# Altium schematic sheet linearInjector_main.SchDoc
size A4
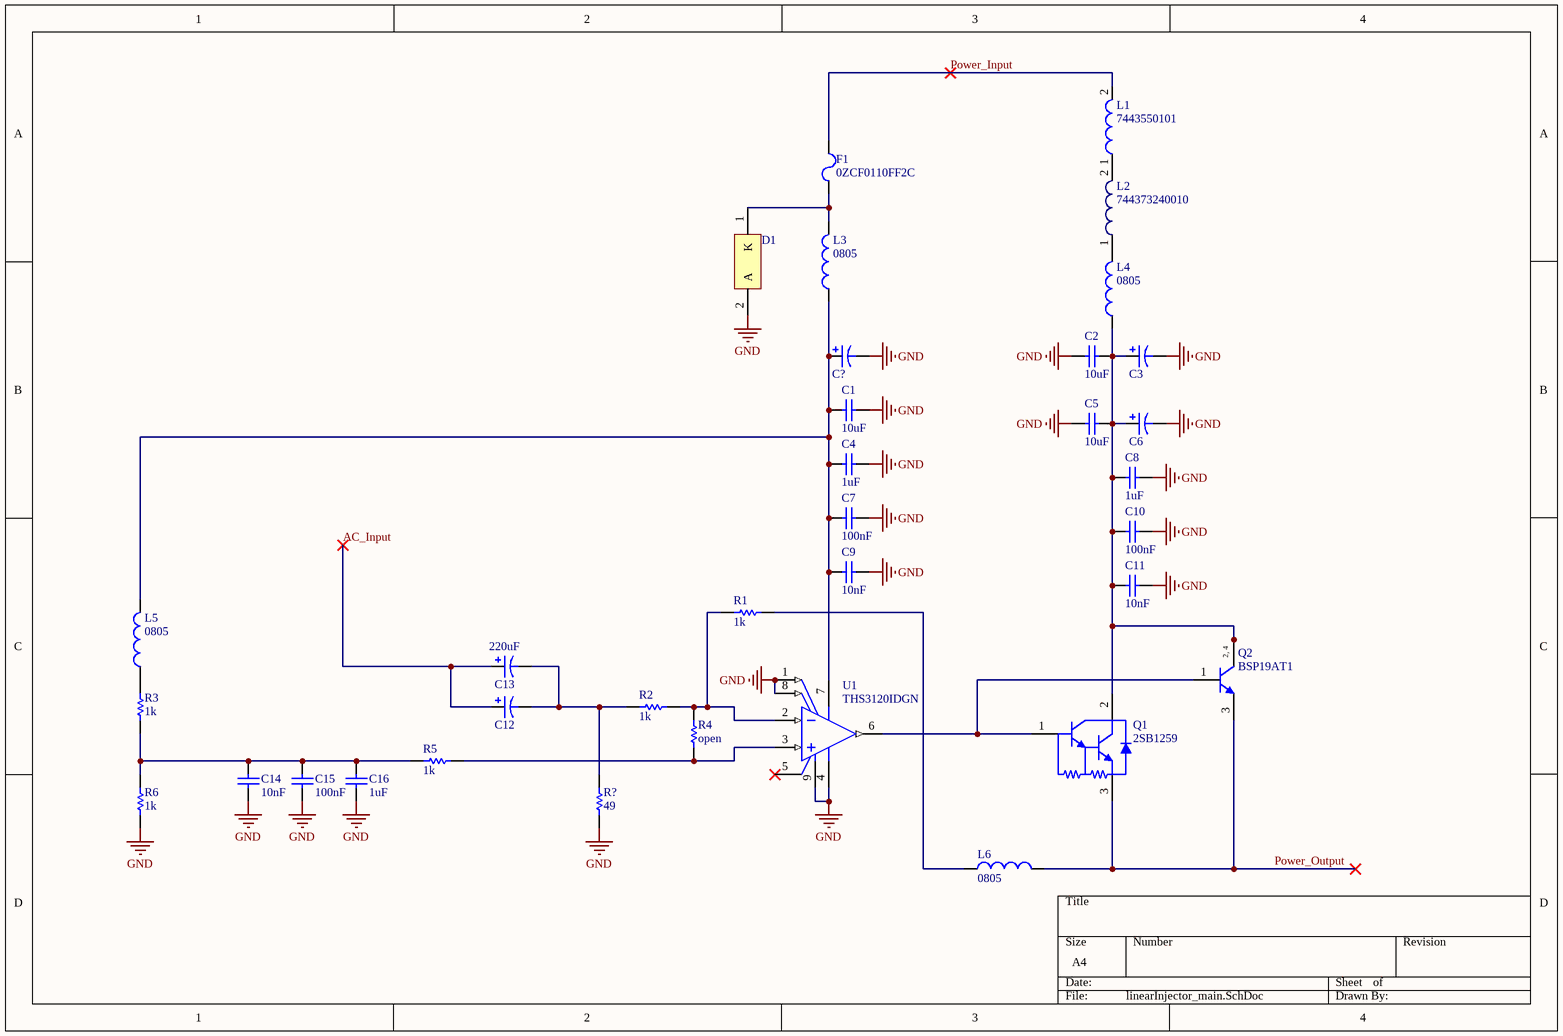
[diagram p0: linearInjector_main.SchDoc]

## Parts
C1  10uF  [CAPC1206(3216)130_M]
C2  10uF  [CAPC1206(3216)130_L]
C3  EEE-FK1E221P  [PNSC-EEE-FK1E221P_N]  (value not drawn)
C4  1uF  [CAPC0805(2012)75_M]
C5  10uF  [CAPC1206(3216)130_L]
C6  EEE-FK1E221P  [PNSC-EEE-FK1E221P_N]  (value not drawn)
C7  100nF  [CAPC0805(2012)75_M]
C8  1uF  [CAPC0805(2012)75_M]
C9  10nF  [CAPC0805(2012)75_M]
C10  100nF  [CAPC0805(2012)75_M]
C11  10nF  [CAPC0805(2012)75_M]
C12  EEE-FK1E221P  [PNSC-EEE-FK1E221P_N]  (value not drawn)
C13  220uF  [PNSC-EEE-FK1E221P_N]
C14  10nF  [CAPC0805(2012)75_M]
C15  100nF  [CAPC0805(2012)75_M]
C16  1uF  [CAPC0805(2012)75_M]
C?  EEE-FK1E221P  [PNSC-EEE-FK1E221P_N]  (value not drawn)
D1  MBRM120LT3  [ONSC-POWERMITE-2-457-04_D_V]  (value not drawn)
F1  0ZCF0110FF2C  [TECO-SMD100F-2_V]
L1  7443550101  [WE-HCI-1350]
L2  744373240010  [WE-LHMI 4020]
L3  0805  [INDC2013X105X50ML20T30]
L4  0805  [INDC2013X105X50ML20T30]
L5  0805  [INDC2013X105X50ML20T30]
L6  0805  [INDC2013X105X50ML20T30]
Q1  2SB1259  [ONSC-TO-220-3-221A-09]
Q2  BSP19AT1  [ONSC-SOT-223-4-318E-04_V]
R1  1k  [RESC0805(2012)_M]
R2  1k  [RESC0805(2012)_M]
R3  1k  [RESC0805(2012)_M]
R4  open  [RESC0805(2012)_M]
R5  1k  [RESC0805(2012)_M]
R6  1k  [RESC0805(2012)_M]
R?  49  [RESC0805(2012)_M]
U1  THS3120IDGN  [DGN0008D_L]

## Nets
GND: C1.2 C2.2 C3.2(-) C4.1 C5.2 C6.2(-) C7.1 C8.1 C9.1 C10.1 C11.1 C14.1 C15.1 C16.1 C?.2(-) D1.2(A) R6.1 R?.1 U1.1(REF) U1.4(VS-) U1.8(PD) U1.9(EP)
AC_Input: C12.1(+) C13.1(+)
Power_Input: F1.2 L1.2
Power_Output: L6.2 Q1.3(E) Q2.3(E)
NetC1_1: C1.1 C4.2 C7.2 C9.2 C?.1(+) L3.1 L5.2 U1.7(VS+)
NetC2_1: C2.1 C3.1(+) C5.1 C6.1(+) C8.2 C10.2 C11.2 L4.1 Q1.2(C) Q2.2(C) Q2.4(C)
NetC12_2: C12.2(-) C13.2(-) R2.1 R?.2
NetC14_2: C14.2 C15.2 C16.2 R3.1 R5.1 R6.2
NetD1_1: D1.1(K) F1.1 L3.2
NetL1_1: L1.1 L2.2
NetL2_1: L2.1 L4.2
NetL5_1: L5.1 R3.2
NetL6_1: L6.1 R1.2
NetQ1_1: Q1.1(B) Q2.1(B) U1.6(VOUT)
NetR1_1: R1.1 R2.2 R4.2 U1.2(VIN-)
NetR4_1: R4.1 R5.2 U1.3(VIN+)

Not connected (* = marked no-connect by the designer): U1 5(NC)*

## Notes on the sheet
- (in symbol CMP-1048-00457-1) 2, 4

## Library data of the parts
C1 C2 C5 = CMP-1037-04970-1: Case-Metric: 3216; Rated Voltage: 10 V; Tolerance: -20% to +80%; Case-EIA: 1206; Value: 10uF; Technology: SMT; Max Thickness: 1.3 mm
C3 C6 C12 C? = CMP-1665-00017-1: CAP ALUM 220UF 20% 25V SMD; Datasheet: http://industrial.panasonic.com/cdbs/www-data/pdf/RDE0000/ABA0000C1181.pdf; Partnumber: EEE-FK1E221P
C4 C7 C8 C10 C15 C16 = CMP-1036-03812-1: Case-EIA: 0805; Value: 10nF; Rated Voltage: 10 V; Tolerance: -20% to +80%; Case-Metric: 2012; Technology: SMT; Max Thickness: 0.75 mm
C9 C11 C14 = CMP-1036-03812-1: Case-EIA: 0805; Rated Voltage: 10 V; Tolerance: -20% to +80%; Case-Metric: 2012; Technology: SMT; Max Thickness: 0.75 mm; Value: 10nF
C13 = CMP-1665-00017-1: CAP ALUM 220UF 20% 25V SMD EEE-FK1E221P; Datasheet: http://industrial.panasonic.com/cdbs/www-data/pdf/RDE0000/ABA0000C1181.pdf; Partnumber: EEE-FK1E221P
D1 = CMP-1055-00282-1: Schottky Power Rectifier, 2-Pin Powermite, Tape and Reel; Manufacturer: On Semiconductor; Note1: 0; IFSM Max (A): 50; Configuration: Single; Mounting Technology: Surface Mount; PackageReference: POWERMITE-2-457-04; PackageDescription: 2-Pin POWERMITE, Body 1.965 x 1.9 mm; PackageVersion: Rev. F, 05/2013; RoHS: FALSE; DatasheetVersion: Rev. 7; ComponentLink3URL: http://www.onsemi.com/pub_link/Collateral/457-04.PDF; ComponentLink2Description: Datasheet; ComponentLink3Description: Package Specification; ComponentLink1URL: http://www.onsemi.com/; ComponentLink1Description: Manufacturer URL; ComponentLink2URL: http://www.onsemi.cn/pub_link/Collateral/MBRM120L-D.PDF; PartNumber: MBRM120LT3; Packing: Tape and Reel
F1 = CMP-2000-05420-1: ptc; Manufacturer: TEConnectivity/CircuitProtection; Part No: SMD100F-2; Typical Power Dissipation: 1.7(Max)W; Agency Approvals: CSA/TUV/UL; Lead Diameter: N/R; Minimum Initial Resistance: 0.12Ohm; Hold Current: 1.1A; Trip Current: 2.2A; Maximum Voltage Rating: 30V; Maximum Post Trip Resistance: 0.48Ohm; Maximum Current Rating: 40A; Datasheet URL: http://datasheet.octopart.com/SMD100F-2-Tyco-Electronics-datasheet-11085073.pdf; Mounting: SurfaceMount; Applications: N/A; Terminal Pitch: N/A; Dimension: N/A; RoHS: Yes; Package Reference: SMD100F-2; Package Description: 2-Pin Surface Mount Device, Body 7.34 x 5.12 mm; Operating Temperature: 85(Max)C; Wire Form: N/R; Number of Terminals: 2; Maximum Trip Time: N/A; Seated Plane Height: N/R; Manufacturer URL: http://www.te.com/; Package/Case: 2920; Family: SMD; Packaging: TapeandReel; Datasheet Version: May-11; Maximum Initial Resistance: N/A
L1 = CMP-0226-00031-1: SMD Flat Wire High Current Inductor WE-HCI, L=10.0 µH; Inductance: 10.0 ÂµH; DatasheetVersion: ver 1, Aug-2009; ComponentLink2Description: Datasheet; PackageDescription: Inductor, 2-Leads, Body 13.0 x 12.8 mm; ComponentLink2URL: http://www.we-online.de/katalog/media/pdf/7443550101.pdf; PackageReference: WE-HCI-1350; ComponentLink1URL: http://www.we-online.com; PackageVersion: 2008; ComponentLink1Description: Manufacturer Link
L2 = CMP-1353-00038-1: SMD Power Inductor WE-LHMI, L=0.10 µH; Manufacturer: Wuerth Elektronik; Inductance: 0.10 ÂµH; ComponentLink2URL: http://katalog.we-online.de/kataloge/eisos/media/pdf/744373240010.pdf; ComponentLink2Description: Datasheet; PartNumber: 744373240010; ComponentLink1URL: http://www.we-online.com; ComponentLink1Description: Manufacturer URL; PackageReference: WE-LHMI 4020
L3-L6 = CMP-1660-00003-1: Core Material: Ferrite; Current Rating: 6 A; Tolerance: 30%; Resistance: 4 mohm; Impedance: 21 Ohm; Min Operating Temperature: -40 degC; Width: 1.25 mm; PackageDescription: 2-Pin Surface Mount Device, Body 2 x 1.25 mm; Mounting Technology: Surface Mount; Package Quantity: 1; DatasheetVersion: 08/2016; Mount: Surface Mount; Max Operating Temperature: 125 degC; Height: 0.85 mm; ComponentLink1URL: http://www.t-yuden.com/; Case Code (Metric): 2012; ComponentLink1Description: Manufacturer URL; Case\Package: 0805; ComponentLink2URL: http://ds.yuden.co.jp/TYCOMPAS/ut/detail.do?productNo=FBMJ2125HM210NT&fileName=FBMJ2125HM210NT_SS&mode=specSheetDownload; Case Code (Imperial): 0805; Packaging: Tape and Reel; ComponentLink2Description: Datasheet; PackageReference: 0805; RoHSCompliant: true; Max Current Rating: 6 A; Length: 2 mm; REACH SVHC: Unknown
Q1 = CMP-1031-00034-1: PartNumber: MJE5740G; Manufacturer: On Semiconductor; Packing: Tube; Polarity: NPN; IC Continuous (A): 8; PackageReference: TO-220-3-221A-09; ComponentLink2URL: http://www.onsemi.com/pub_link/Collateral/MJE5740-D.PDF; ComponentLink1URL: http://www.onsemi.com/; Mounting Technology: Through Hole; ComponentLink2Description: Datasheet; ComponentLink1Description: Manufacturer URL; ComponentLink3URL: http://www.onsemi.com/pub_link/Collateral/221A-09.PDF; PackageDescription: 3-Pin Flange Mount, Vertical Straight Lead, Body 9.97 x 4.445 mm, Pitch 2.54 mm; PackageVersion: Rev. AG, 09/2011; DatasheetVersion: Rev. 11; RoHS: TRUE; ComponentLink3Description: Package Specification
Q2 = CMP-1048-00457-1: NPN Silicon Expitaxial Transistor, 4-Pin SOT-223, Tape and Reel; Manufacturer: On Semiconductor; fT Min (MHz): 70; IC Continuous (A): 0.1; PackageDescription: 4-Pin Small Outline Transistor, Body 6.5 x 3.5 mm, Pitch 2.3 mm; ComponentLink3URL: http://www.onsemi.com/pub_link/Collateral/318E-04.PDF; PartNumber: BSP19AT1; Mounting Technology: Surface Mount; Polarity: NPN; DatasheetVersion: Rev. 11; ComponentLink1URL: http://www.onsemi.com/; Packing: Tape and Reel; RoHS: FALSE; ComponentLink2URL: http://www.onsemi.com/pub_link/Collateral/BSP19AT1-D.PDF; ComponentLink3Description: Package Specification; ComponentLink2Description: Datasheet; ComponentLink1Description: Manufacturer URL; PackageReference: SOT-223-4-318E-04; PackageVersion: Rev. N, 08/2009
R1-R3 R5 R6 R? = CMP-1013-00536-1: 1k 1%; Value: 1780.00 Ohm; Case-EIA: 0805; Case-Metric: 2012; Power: 0.125 W; Tolerance: 1 %; Technology: SMT
R4 = CMP-1013-00536-1: Tolerance: 1 %; Value: 1780.00 Ohm; Case-EIA: 0805; Case-Metric: 2012; Power: 0.125 W; Technology: SMT
U1 = CMP-0018-00648-2: Single, Low Noise, High Output Drive, 475 mA Current-Feedback Amplifier with Power-Down, 10 to 30 V, -40 to 85 degC, 8-pin SOP (DGN8), Green (RoHS & no Sb/Br); Manufacturer: Texas Instruments; Vs(Min)(V): 10; Vio(Max)(mV): 8; 3rd Harmonic(dBc): 50; Vn at Flatband(Typ)(nV/rtHz): 2.5; Io(Typ)(mA): 475; THD (Fc is 1 MHz)(Typ)(dB): -78; Sub Family: High Output Current Amplifier (>=50mA), High Speed Amplifier (>=50MHz), High Supply Voltage Amplifier (>=30V); Diff Gain(%): 0.007; Vs(Max)(V): 30; Settling Time (0.1%)(Typ)(ns): 11; Acl, min stable gain(V/V): 1; Iib(Max)(nA): 20000; 2nd Harmonic(dBc): 51; Diff Phase(deg): 0.018; Slew Rate(Typ)(V/us): 1700; BW @ Acl(MHz): 130; PackageVersion: 4073271/F, 05/2011; ComponentLink2URL: http://www.ti.com/general/docs/lit/getliterature.tsp?genericPartNumber=THS3120&fileType=pdf; @ MHz: 10; PackageReference: DGN0008D; Eco-Plan: Green (RoHS & no Sb/Br); Code_JEDEC: MO-187; ComponentLink1URL: http://www.ti.com/; ComponentLink3Description: Package Specification; ComponentLink3URL: http://www.ti.com/litv/pdf/mpds046e; PartNumber: THS3120IDGN; ComponentLink1Description: Manufacturer URL; ComponentLink2Description: Datasheet; PackageDescription: 8-pin Plastic Small Outline, Body 3 x 3 mm, Pitch 0.65 mm; DatasheetVersion: SLOS420E; Number of Channels: 1; Iq per channel(Max)(mA): 11; Mounting Technology: Surface Mount